# Altium schematic sheet Schematics.SchDoc
size 254 x 152 mm; SheetNumber: 1; SheetTotal: 1
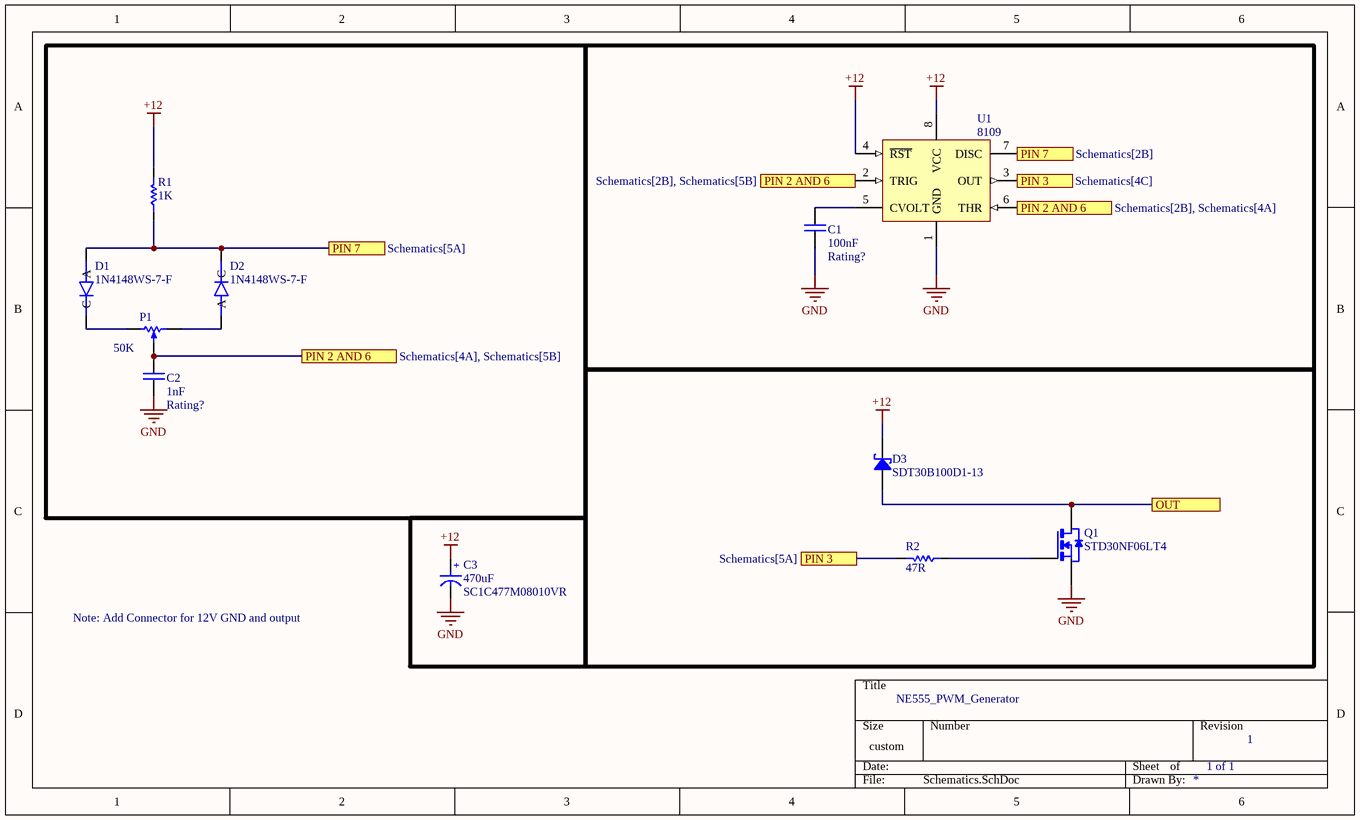
[diagram p0: Schematics.SchDoc]

## Parts
C1  Rating: Rating?  [CAP 1206/3216]  (hidden comment: 100nF)
C2  Rating: Rating?  [CAP 1206/3216]  (hidden comment: 1nF)
C3  Rating: SC1C477M08010VR  [CAP ALUM 8.3MM]  (hidden comment: 470uF)
D1  1N4148WS-7-F  [SOD2513X120N]
D2  1N4148WS-7-F  [SOD2513X120N]
D3  SDT30B100D1-13  [50WQ03]
P1  50K  [POT_WH148]
Q1  Inflow: STD30NF06LT4  [TO252-3L]  (hidden comment: AOD472)
R1  1K  [RES 1206 (3216X08L)]
R2  47R  [RES 1206 (3216X08L)]
U1  Inflow: 8109  [SO8_narrow_n]  (hidden comment: NE555)

## Ports
OUT, PIN 2 AND 6 (see Schematics[2B], Schematics[4A]), PIN 2 AND 6 (see Schematics[2B], Schematics[5B]), PIN 2 AND 6 (see Schematics[4A], Schematics[5B]), PIN 3 (see Schematics[4C]), PIN 3 (see Schematics[5A]), PIN 7 (see Schematics[2B]), PIN 7 (see Schematics[5A])

## Nets
+12: C3.1(+) D3.2 R1.2 U1.4(~{RST}) U1.8(VCC)
GND: C1.2 C2.2 C3.2(-) Q1.3(S) U1.1(GND)
OUT: D3.1 Q1.4(D) ; port OUT
PIN 2 AND 6: C2.1 P1.2(WIPER) U1.2(TRIG) U1.6(THR) ; port PIN 2 AND 6
PIN 3: R2.2 U1.3(OUT) ; port PIN 3
PIN 7: D1.A D2.C R1.1 U1.7(DISC) ; port PIN 7
NetC1_1: C1.1 U1.5(CVOLT)
NetD1_C: D1.C P1.3(CW)
NetD2_A: D2.A P1.1(CCW)
NetQ1_1: Q1.1(G) R2.1

## Notes on the sheet
- Note: Add Connector for 12V GND and output
- NE555_PWM_Generator
- 1 of 1
- 1

## Library data of the parts
C1 C2 = Cap_Multi_SMD: Bipolar ceramic capacitor SMD; Inflow: inflow?; Type: Type?; Validation: Valid; Package: Package?
  C1: Value: 100nF
  C2: Value: 1nF
C3 = Cap_Electrolit_SMD: Electrolit Capacitor SMD; Inflow: inflow?; Validation: Valid; Type: Electrolit; Package: SMD; Value: 470uF
D1 D2 = 1N4148WS-7-F: Diode Switching 75V 0.3A 2-Pin SOD-323 | Diodes Inc 1N4148WS-7-F; MF: Diodes Inc.; SnapEDA_Link: https://www.snapeda.com/parts/1N4148WS-7-F/Diodes+Inc./view-part/?ref=snap; Package: SOD-323 Diodes Inc.; Value: *; MP: 1N4148WS-7-F; Check_prices: https://www.snapeda.com/parts/1N4148WS-7-F/Diodes+Inc./view-part/?ref=eda
D3 = Semi_Diod_Sch_50WQ03: Fast soft recovery power rectifier; Rating: Rating?; Type: Schottky; Validation: NT; Inflow: inflow?; Package: TO-252; Value: SDT30B100D1-13
P1 = Res_Pot: Potentiometer; Rating: Rating?; Value: Value?; Validation: Valid; Package: Package?; Type: Type?; Inflow: 50K
Q1 = Semi_MOSFET_AOD472: N-channel MOSFET; Rating: Rating?; Type: Type?; Validation: NT; Value: AOD472; Package: Package?
R1 R2 = Res_SMD: Resistor; Inflow: inflow?; Rating: Rating?; Validation: Valid; Package: Package?; Type: 10%
  R1: Value: 1K
  R2: Value: 47R
U1 = IC_Timer_NE555_SMD: Astable or monostable operation timer; Rating: Rating?; Validation: Valid; Value: NE555; Package: Package?; Type: Type?